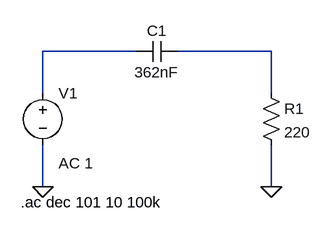
[diagram p0: schematic High Pass Filter.asc]
High Pass Filter.asc, the LTspice schematic file:
Version 4
SHEET 1 880 680
WIRE 16 80 -128 80
WIRE 224 80 80 80
WIRE -128 144 -128 80
WIRE 224 144 224 80
WIRE -128 288 -128 224
WIRE 224 288 224 224
FLAG -128 288 0
FLAG 224 288 0
SYMBOL cap 80 64 R90
WINDOW 0 0 32 VBottom 2
WINDOW 3 32 32 VTop 2
SYMATTR InstName C1
SYMATTR Value 362nF
SYMBOL res 208 128 R0
SYMATTR InstName R1
SYMATTR Value 220
SYMBOL voltage -128 128 R0
WINDOW 123 24 124 Left 2
WINDOW 39 0 0 Left 0
SYMATTR InstName V1
SYMATTR Value ""
SYMATTR Value2 AC 1
TEXT -162 312 Left 2 !.ac dec 101 10 100k

The netlist it stands for:
* High Pass Filter.asc
C1 N002 N001 362nF
R1 N002 0 220
V1 N001 0 AC 1
.ac dec 101 10 100k
.backanno
.end